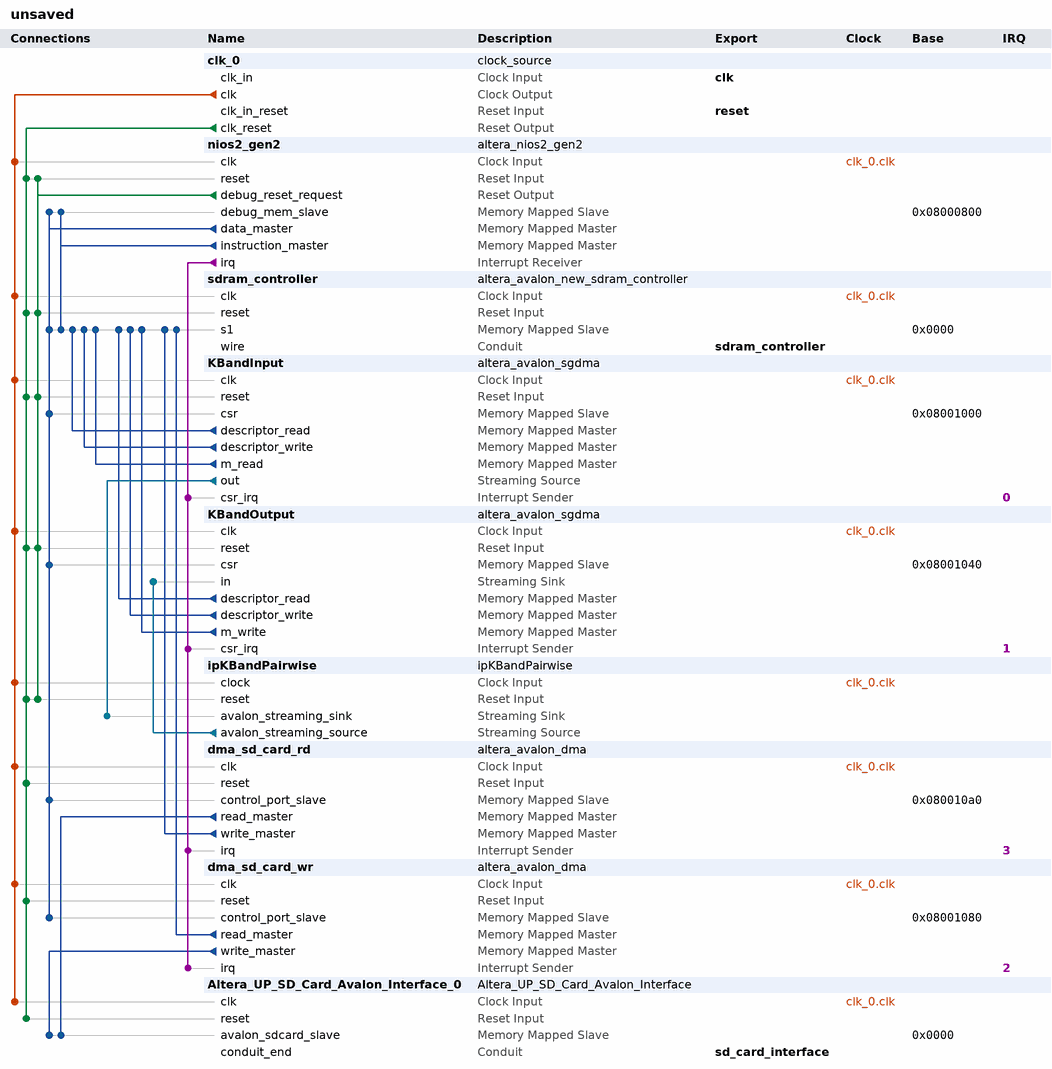
[diagram p0: system contents]
# Platform Designer (Qsys) system unsaved, Cyclone V 5CSXFC6D6F31C6
# Parameters at their usual value, and those the tool derives, are not listed.
package require -exact qsys 16.1
create_system unsaved
set_project_property DEVICE_FAMILY {Cyclone V}
set_project_property DEVICE 5CSXFC6D6F31C6

add_instance clk_0 clock_source 16.1
set_instance_parameter_value clk_0 clockFrequency 50000000

add_instance nios2_gen2 altera_nios2_gen2 16.1
set_instance_parameter_value nios2_gen2 dcache_size 2048
set_instance_parameter_value nios2_gen2 exceptionSlave sdram_controller.s1
set_instance_parameter_value nios2_gen2 icache_size 4096
set_instance_parameter_value nios2_gen2 impl Fast
set_instance_parameter_value nios2_gen2 resetSlave sdram_controller.s1

add_instance sdram_controller altera_avalon_new_sdram_controller 16.1
set_instance_parameter_value sdram_controller TAC 5.5
set_instance_parameter_value sdram_controller TRCD 20.0
set_instance_parameter_value sdram_controller TRP 20.0
set_instance_parameter_value sdram_controller casLatency 3
set_instance_parameter_value sdram_controller columnWidth 10
set_instance_parameter_value sdram_controller dataWidth 32
set_instance_parameter_value sdram_controller generateSimulationModel false
set_instance_parameter_value sdram_controller model single_Micron_MT48LC4M32B2_7_chip
set_instance_parameter_value sdram_controller numberOfBanks 4
set_instance_parameter_value sdram_controller numberOfChipSelects 1
set_instance_parameter_value sdram_controller powerUpDelay 200.0
set_instance_parameter_value sdram_controller refreshPeriod 7.8125
set_instance_parameter_value sdram_controller rowWidth 13

add_instance KBandInput altera_avalon_sgdma 16.1
set_instance_parameter_value KBandInput enableBurstTransfers false
set_instance_parameter_value KBandInput enableUnalignedTransfers false
set_instance_parameter_value KBandInput readBlockDataWidth 32
set_instance_parameter_value KBandInput sinkErrorWidth 0
set_instance_parameter_value KBandInput sourceErrorWidth 0
set_instance_parameter_value KBandInput transferMode MEMORY_TO_STREAM
set_instance_parameter_value KBandInput writeBurstcountWidth 4

add_instance KBandOutput altera_avalon_sgdma 16.1
set_instance_parameter_value KBandOutput enableBurstTransfers false
set_instance_parameter_value KBandOutput enableUnalignedTransfers false
set_instance_parameter_value KBandOutput readBlockDataWidth 32
set_instance_parameter_value KBandOutput sinkErrorWidth 0
set_instance_parameter_value KBandOutput sourceErrorWidth 0
set_instance_parameter_value KBandOutput transferMode STREAM_TO_MEMORY
set_instance_parameter_value KBandOutput writeBurstcountWidth 4

add_instance ipKBandPairwise ipKBandPairwise 1.0

add_instance dma_sd_card_rd altera_avalon_dma 16.1
set_instance_parameter_value dma_sd_card_rd allowByteTransactions false
set_instance_parameter_value dma_sd_card_rd allowDoubleWordTransactions false
set_instance_parameter_value dma_sd_card_rd allowHalfWordTransactions false
set_instance_parameter_value dma_sd_card_rd allowQuadWordTransactions false
set_instance_parameter_value dma_sd_card_rd burstEnable false
set_instance_parameter_value dma_sd_card_rd fifoDepth 32
set_instance_parameter_value dma_sd_card_rd maxBurstSize 128
set_instance_parameter_value dma_sd_card_rd minimumDmaTransactionRegisterWidth 13

add_instance dma_sd_card_wr altera_avalon_dma 16.1
set_instance_parameter_value dma_sd_card_wr allowByteTransactions false
set_instance_parameter_value dma_sd_card_wr allowDoubleWordTransactions false
set_instance_parameter_value dma_sd_card_wr allowHalfWordTransactions false
set_instance_parameter_value dma_sd_card_wr allowQuadWordTransactions false
set_instance_parameter_value dma_sd_card_wr burstEnable false
set_instance_parameter_value dma_sd_card_wr fifoDepth 128
set_instance_parameter_value dma_sd_card_wr maxBurstSize 128
set_instance_parameter_value dma_sd_card_wr minimumDmaTransactionRegisterWidth 13

add_instance Altera_UP_SD_Card_Avalon_Interface_0 Altera_UP_SD_Card_Avalon_Interface 16.1

# connections
add_connection clk_0.clk Altera_UP_SD_Card_Avalon_Interface_0.clk clock
add_connection clk_0.clk dma_sd_card_rd.clk clock
add_connection clk_0.clk dma_sd_card_wr.clk clock
add_connection clk_0.clk ipKBandPairwise.clock clock
add_connection clk_0.clk KBandInput.clk clock
add_connection clk_0.clk KBandOutput.clk clock
add_connection clk_0.clk nios2_gen2.clk clock
add_connection clk_0.clk sdram_controller.clk clock
add_connection clk_0.clk_reset Altera_UP_SD_Card_Avalon_Interface_0.reset reset
add_connection clk_0.clk_reset dma_sd_card_rd.reset reset
add_connection clk_0.clk_reset dma_sd_card_wr.reset reset
add_connection clk_0.clk_reset ipKBandPairwise.reset reset
add_connection clk_0.clk_reset KBandInput.reset reset
add_connection clk_0.clk_reset KBandOutput.reset reset
add_connection clk_0.clk_reset nios2_gen2.reset reset
add_connection clk_0.clk_reset sdram_controller.reset reset
add_connection nios2_gen2.debug_reset_request ipKBandPairwise.reset reset
add_connection nios2_gen2.debug_reset_request KBandInput.reset reset
add_connection nios2_gen2.debug_reset_request KBandOutput.reset reset
add_connection nios2_gen2.debug_reset_request nios2_gen2.reset reset
add_connection nios2_gen2.debug_reset_request sdram_controller.reset reset
add_connection dma_sd_card_rd.read_master Altera_UP_SD_Card_Avalon_Interface_0.avalon_sdcard_slave avalon
set_connection_parameter_value dma_sd_card_rd.read_master/Altera_UP_SD_Card_Avalon_Interface_0.avalon_sdcard_slave baseAddress 0x0000
add_connection dma_sd_card_rd.write_master sdram_controller.s1 avalon
set_connection_parameter_value dma_sd_card_rd.write_master/sdram_controller.s1 baseAddress 0x0000
add_connection dma_sd_card_wr.read_master sdram_controller.s1 avalon
set_connection_parameter_value dma_sd_card_wr.read_master/sdram_controller.s1 baseAddress 0x0000
add_connection dma_sd_card_wr.write_master Altera_UP_SD_Card_Avalon_Interface_0.avalon_sdcard_slave avalon
set_connection_parameter_value dma_sd_card_wr.write_master/Altera_UP_SD_Card_Avalon_Interface_0.avalon_sdcard_slave baseAddress 0x0000
add_connection KBandInput.descriptor_read sdram_controller.s1 avalon
set_connection_parameter_value KBandInput.descriptor_read/sdram_controller.s1 baseAddress 0x0000
add_connection KBandInput.descriptor_write sdram_controller.s1 avalon
set_connection_parameter_value KBandInput.descriptor_write/sdram_controller.s1 baseAddress 0x0000
add_connection KBandInput.m_read sdram_controller.s1 avalon
set_connection_parameter_value KBandInput.m_read/sdram_controller.s1 baseAddress 0x0000
add_connection KBandOutput.descriptor_read sdram_controller.s1 avalon
set_connection_parameter_value KBandOutput.descriptor_read/sdram_controller.s1 baseAddress 0x0000
add_connection KBandOutput.descriptor_write sdram_controller.s1 avalon
set_connection_parameter_value KBandOutput.descriptor_write/sdram_controller.s1 baseAddress 0x0000
add_connection KBandOutput.m_write sdram_controller.s1 avalon
set_connection_parameter_value KBandOutput.m_write/sdram_controller.s1 baseAddress 0x0000
add_connection nios2_gen2.data_master dma_sd_card_rd.control_port_slave avalon
set_connection_parameter_value nios2_gen2.data_master/dma_sd_card_rd.control_port_slave baseAddress 0x080010a0
add_connection nios2_gen2.data_master dma_sd_card_wr.control_port_slave avalon
set_connection_parameter_value nios2_gen2.data_master/dma_sd_card_wr.control_port_slave baseAddress 0x08001080
add_connection nios2_gen2.data_master KBandInput.csr avalon
set_connection_parameter_value nios2_gen2.data_master/KBandInput.csr baseAddress 0x08001000
add_connection nios2_gen2.data_master KBandOutput.csr avalon
set_connection_parameter_value nios2_gen2.data_master/KBandOutput.csr baseAddress 0x08001040
add_connection nios2_gen2.data_master nios2_gen2.debug_mem_slave avalon
set_connection_parameter_value nios2_gen2.data_master/nios2_gen2.debug_mem_slave baseAddress 0x08000800
add_connection nios2_gen2.data_master sdram_controller.s1 avalon
set_connection_parameter_value nios2_gen2.data_master/sdram_controller.s1 baseAddress 0x0000
add_connection nios2_gen2.instruction_master nios2_gen2.debug_mem_slave avalon
set_connection_parameter_value nios2_gen2.instruction_master/nios2_gen2.debug_mem_slave baseAddress 0x08000800
add_connection nios2_gen2.instruction_master sdram_controller.s1 avalon
set_connection_parameter_value nios2_gen2.instruction_master/sdram_controller.s1 baseAddress 0x0000
add_connection ipKBandPairwise.avalon_streaming_source KBandOutput.in avalon_streaming
add_connection KBandInput.out ipKBandPairwise.avalon_streaming_sink avalon_streaming
add_connection nios2_gen2.irq dma_sd_card_rd.irq interrupt
set_connection_parameter_value nios2_gen2.irq/dma_sd_card_rd.irq irqNumber 3
add_connection nios2_gen2.irq dma_sd_card_wr.irq interrupt
set_connection_parameter_value nios2_gen2.irq/dma_sd_card_wr.irq irqNumber 2
add_connection nios2_gen2.irq KBandInput.csr_irq interrupt
set_connection_parameter_value nios2_gen2.irq/KBandInput.csr_irq irqNumber 0
add_connection nios2_gen2.irq KBandOutput.csr_irq interrupt
set_connection_parameter_value nios2_gen2.irq/KBandOutput.csr_irq irqNumber 1

# exported interfaces
add_interface clk clock sink
set_interface_property clk EXPORT_OF clk_0.clk_in
add_interface reset reset sink
set_interface_property reset EXPORT_OF clk_0.clk_in_reset
add_interface sd_card_interface conduit end
set_interface_property sd_card_interface EXPORT_OF Altera_UP_SD_Card_Avalon_Interface_0.conduit_end
add_interface sdram_controller conduit end
set_interface_property sdram_controller EXPORT_OF sdram_controller.wire

set_interconnect_requirement {$system} qsys_mm.clockCrossingAdapter HANDSHAKE
set_interconnect_requirement {$system} qsys_mm.enableEccProtection FALSE
set_interconnect_requirement {$system} qsys_mm.insertDefaultSlave FALSE
set_interconnect_requirement {$system} qsys_mm.maxAdditionalLatency 1

save_system unsaved.qsys
